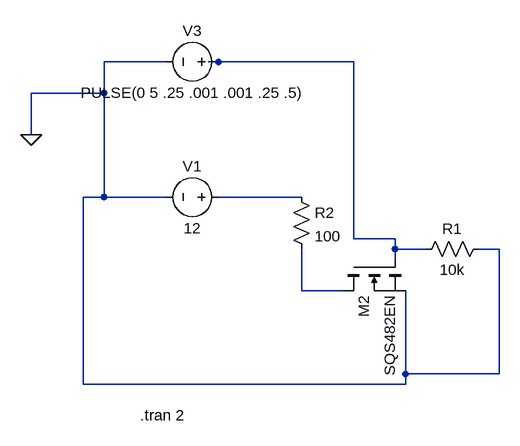
[diagram p0: schematic SensorOffSwitch.asc]
SensorOffSwitch.asc, the LTspice schematic file:
Version 4
SHEET 1 880 680
WIRE 144 -64 48 -64
WIRE 224 -64 208 -64
WIRE 432 -64 224 -64
WIRE 48 -16 48 -64
WIRE 48 -16 -64 -16
WIRE -64 48 -64 -16
WIRE 48 144 48 -16
WIRE 48 144 16 144
WIRE 144 144 48 144
WIRE 352 144 224 144
WIRE 432 208 432 -64
WIRE 496 208 432 208
WIRE 496 224 496 208
WIRE 544 224 496 224
WIRE 656 224 624 224
WIRE 496 240 496 224
WIRE 352 288 352 224
WIRE 416 288 352 288
WIRE 512 416 512 288
WIRE 656 416 656 224
WIRE 656 416 512 416
WIRE 16 432 16 144
WIRE 512 432 512 416
WIRE 512 432 16 432
FLAG -64 48 0
SYMBOL voltage 240 144 R90
WINDOW 0 -32 56 VBottom 2
WINDOW 3 32 56 VTop 2
WINDOW 123 0 0 Left 0
WINDOW 39 0 0 Left 0
SYMATTR InstName V1
SYMATTR Value 12
SYMBOL res 336 128 R0
SYMATTR InstName R2
SYMATTR Value 100
SYMBOL voltage 240 -64 R90
WINDOW 0 -32 56 VBottom 2
WINDOW 3 32 56 VTop 2
WINDOW 123 0 0 Left 0
WINDOW 39 0 0 Left 0
SYMATTR InstName V3
SYMATTR Value PULSE(0 5 .25 .001 .001 .25 .5)
SYMBOL nmos 416 240 M90
SYMATTR InstName M2
SYMATTR Value SQS482EN
SYMBOL res 640 208 R90
WINDOW 0 0 56 VBottom 2
WINDOW 3 32 56 VTop 2
SYMATTR InstName R1
SYMATTR Value 10k
TEXT 104 480 Left 2 !.tran 2

The netlist it stands for:
* SensorOffSwitch.asc
V1 N002 0 12
R2 N002 N003 100
V3 N001 0 PULSE(0 5 .25 .001 .001 .25 .5)
M2 N003 N001 0 0 SQS482EN
R1 0 N001 10k
.model NMOS NMOS
.model PMOS PMOS
.lib standard.mos
.tran 2
.backanno
.end